# EAGLE design expansion-sn76489-kempton-sd-rev7 (EAGLE 9.6.2)
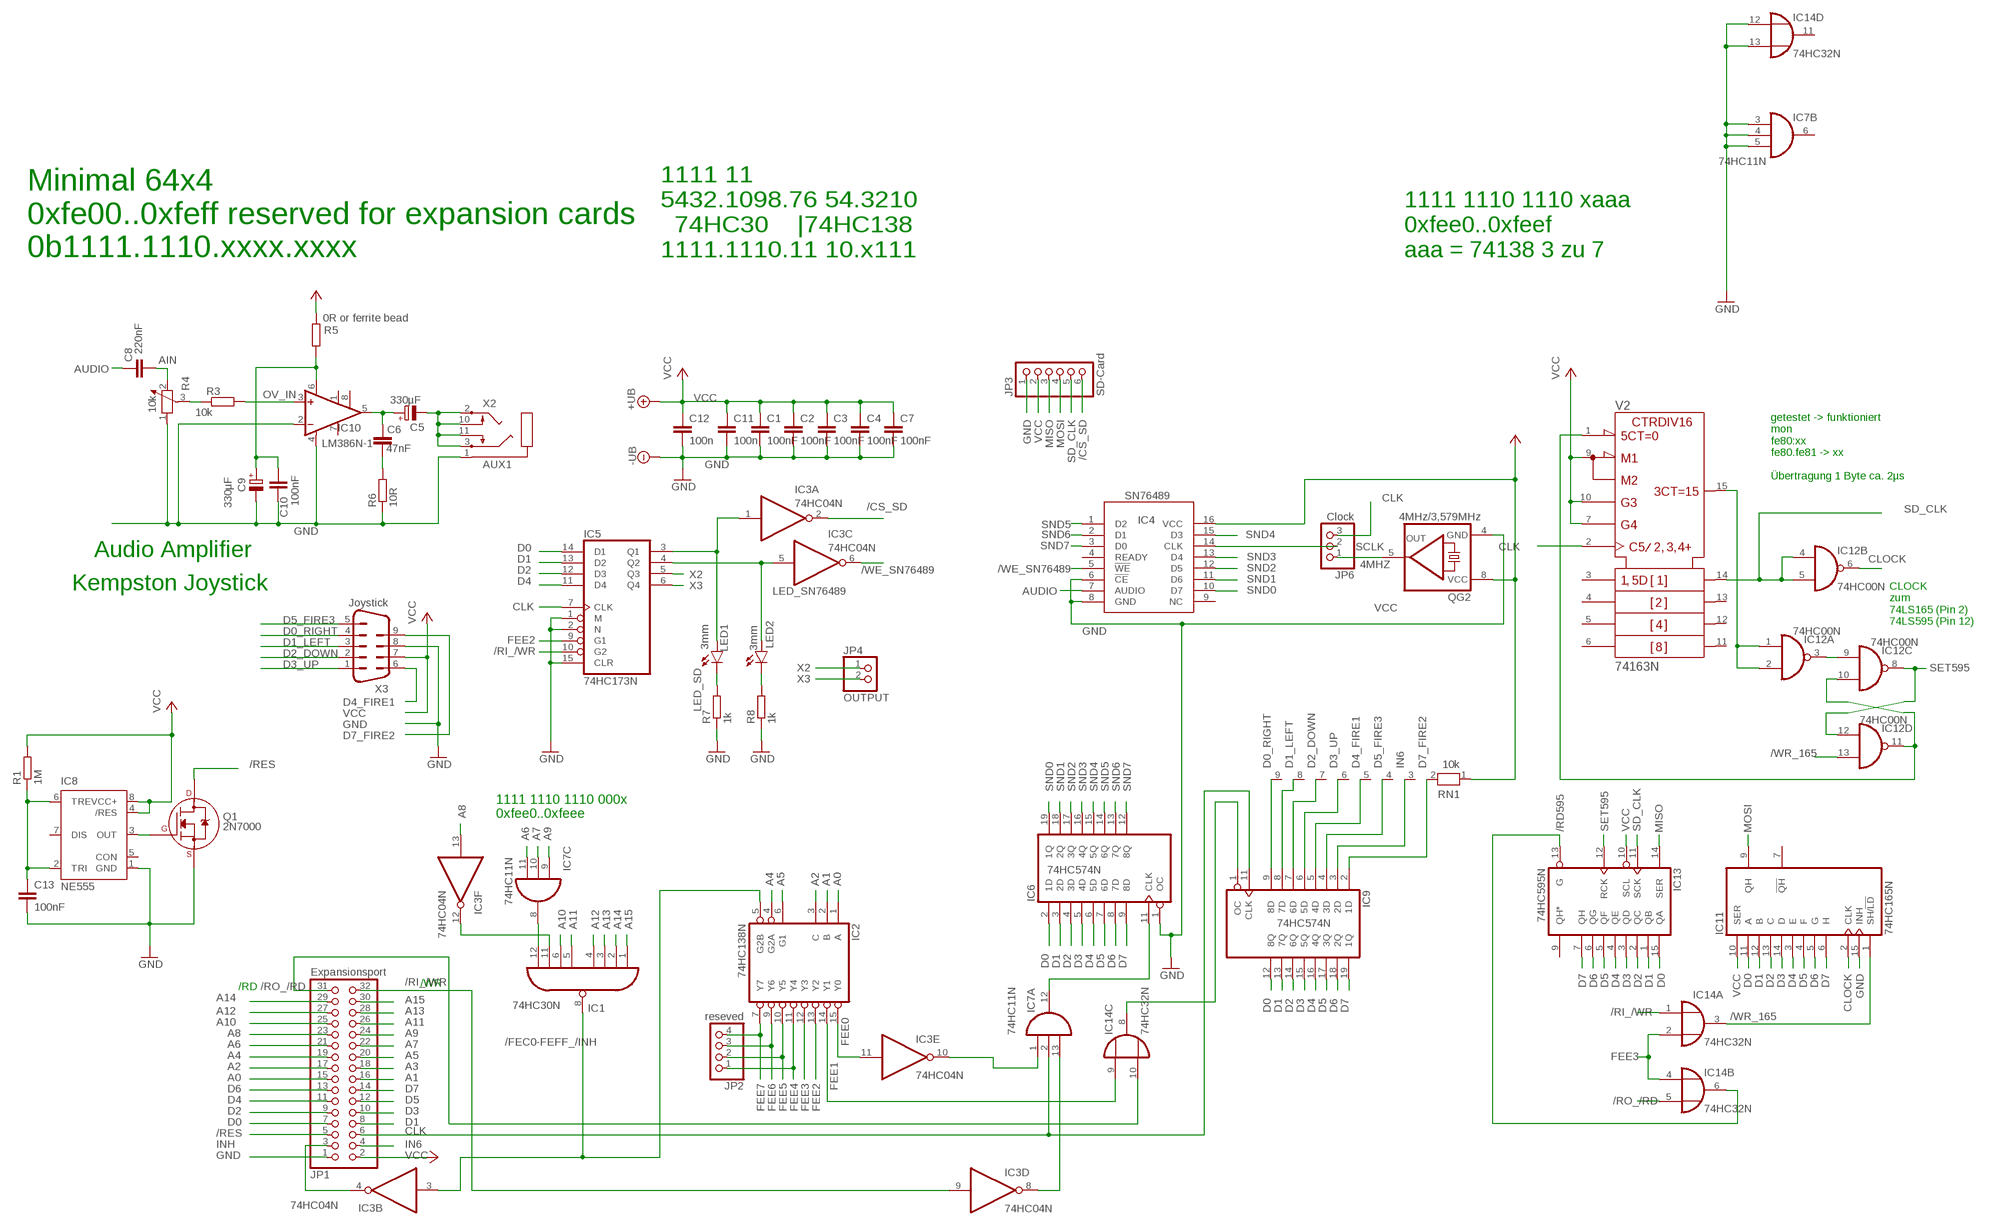
[diagram p0: schematic, sheet 1]

## Parts
C1  100nF  C-EU050-025X075  [C050-025X075]
C2  100nF  C-EU050-025X075  [C050-025X075]
C3  100nF  C-EU050-025X075  [C050-025X075]
C4  100nF  C-EU050-025X075  [C050-025X075]
C5  330µF  CPOL-EUE2.5-7  [E2,5-7]
C6  47nF  C-EU050-025X075  [C050-025X075]
C7  100nF  C-EU050-025X075  [C050-025X075]
C8  220nF  C-EU050-025X075  [C050-025X075]
C9  330µF  CPOL-EUE2.5-7  [E2,5-7]
C10  100nF  C-EU050-025X075  [C050-025X075]
C11  100n  C-EU050-025X075  [C050-025X075]
C12  100n  C-EU050-025X075  [C050-025X075]
C13  100nF  C-EU050-030X075  [C050-030X075]
IC1  74HC30N  [DIL14]
IC2  74HC138N  [DIL16]
IC3  74HC04N  [DIL14]
IC4  SN76489  ALEX-PARTS_SN76489AN  [ALEX-PARTS_DIL16]
IC5  74HC173N  [DIL16]
IC6  74HC574N  [DIL20]
IC7  74HC11N  [DIL14]
IC8  NE555  [DIL-08]
IC9  74HC574N  [DIL20]
IC10  LM386N-1  [DIL08]
IC11  74HC165N  [DIL16]
IC12  74HC00N  [DIL14]
IC13  74HC595N  [DIL16]
IC14  74HC32N  [DIL14]
JP1  Expansionsport  PINHD-2X16  [2X16]
JP2  reseved  PINHD-1X4  [1X04]
JP3  SD-Card  PINHD-1X6  [1X06]
JP4  OUTPUT  PINHD-1X2  [1X02]
JP6  Clock  PINHD-1X3  [1X03]
LED1  3mm  LED3MM  [LED3MM]
LED2  3mm  LED3MM  [LED3MM]
Q1  2N7000  2N7000_TO92  [TO-92]
QG2  4MHz/3,579MHz  QG5460  [DIL08S]
R1  1M  R-EU_0207/10  [0207/10]
R3  10k  R-EU_0207/10  [0207/10]
R4  10k  POTENTIOMETER_PT-10S  [PT-10S]
R5  0R or ferrite bead  R-EU_0207/10  [0207/10]
R6  10R  R-EU_0207/10  [0207/10]
R7  1k  R-EU_0207/2V  [0207/2V]
R8  1k  R-EU_0207/2V  [0207/2V]
RN1  10k  RN08  [RN-9]
V2  74163N  [DIL16]
X2  AUX1  CON-SJ1-352XNSJ1-352XN  [SJ1-352XN]
X3  Joystick  M09-182  [182-009-MALE]

## Nets
4MHZ: JP6.1 QG2.5(OUT)
/CS_SD: IC3.2(A:O) JP3.6
/FEC0-FEFF_/INH: IC1.8(O) IC2.5(G2B) IC3.3(B:I)
/RD595: IC13.13(G) IC14.6(B:O)
/RES: JP1.5 Q1.3(D)
/RI_/WR: IC3.9(D:I) IC5.10(G2) IC14.1(A:I0) JP1.32
/RO_/RD: IC14.5(B:I1) IC14.10(C:I1) JP1.31
/WE_SN76489: IC3.6(C:O) IC4.5(!WE)
/WR_165: IC11.1(SH/!LD) IC12.13(D:I1) IC14.3(A:O)
A0: IC2.1(A) JP1.15
A1: IC2.2(B) JP1.16
A2: IC2.3(C) JP1.17
A3: JP1.18
A4: IC2.4(G2A) JP1.19
A5: IC2.6(G1) JP1.20
A6: IC7.11(C:I2) JP1.21
A7: IC7.10(C:I1) JP1.22
A8: IC3.13(F:I) JP1.23
A9: IC7.9(C:I0) JP1.24
A10: IC1.6(I5) JP1.25
A11: IC1.5(I4) JP1.26
A12: IC1.4(I3) JP1.27
A13: IC1.3(I2) JP1.28
A14: IC1.2(I1) JP1.29
A15: IC1.1(I0) JP1.30
AIN: C8.2 R4.2
AUDIO: C8.1 IC4.7(AUDIO)
AUXOUT1: C5.- X2.2 X2.3 X2.10 X2.11
AVCC [power]: C9.+ C10.1 IC10.6(VS) R5.1
CLK: IC5.7(CLK) IC7.2(A:I1) IC9.11(CLK) JP1.6 JP6.3 V2.2(CLK)
CLOCK: IC11.2(CLK) IC12.6(B:O)
D0: IC5.14(D1) IC6.2(1D) IC9.12(8Q) IC11.11(A) IC13.15(QA) JP1.7
D0_RIGHT: IC9.9(8D) RN1.9 X3.4
D1: IC5.13(D2) IC6.3(2D) IC9.13(7Q) IC11.12(B) IC13.1(QB) JP1.8
D1_LEFT: IC9.8(7D) RN1.8 X3.3
D2: IC5.12(D3) IC6.4(3D) IC9.14(6Q) IC11.13(C) IC13.2(QC) JP1.9
D2_DOWN: IC9.7(6D) RN1.7 X3.2
D3: IC6.5(4D) IC9.15(5Q) IC11.14(D) IC13.3(QD) JP1.10
D3_UP: IC9.6(5D) RN1.6 X3.1
D4: IC5.11(D4) IC6.6(5D) IC9.16(4Q) IC11.3(E) IC13.4(QE) JP1.11
D4_FIRE1: IC9.5(4D) RN1.5 X3.6
D5: IC6.7(6D) IC9.17(3Q) IC11.4(F) IC13.5(QF) JP1.12
D5_FIRE3: IC9.4(3D) RN1.4 X3.5
D6: IC6.8(7D) IC9.18(2Q) IC11.5(G) IC13.6(QG) JP1.13
D7: IC6.9(8D) IC9.19(1Q) IC11.6(H) IC13.7(QH) JP1.14
D7_FIRE2: IC9.2(1D) RN1.2 X3.9
FEE0: IC2.15(Y0) IC3.11(E:I)
FEE1: IC2.14(Y1) IC14.9(C:I0)
FEE2: IC2.13(Y2) IC5.9(G1)
FEE3: IC2.12(Y3) IC14.2(A:I1) IC14.4(B:I0)
FEE4: IC2.11(Y4) JP2.1
FEE5: IC2.10(Y5) JP2.2
FEE6: IC2.9(Y6) JP2.3
FEE7: IC2.7(Y7) JP2.4
GND [power]: C1.2 C2.2 C3.2 C4.2 C7.2 C9.- C10.2 C11.2 C12.2 C13.2 IC4.6(!CE) IC4.8(GND) IC5.1(M) IC5.2(N) IC5.15(CLR) IC6.1(OC) IC7.3(B:I0) IC7.4(B:I1) IC7.5(B:I2) IC8.1(GND) IC10.2(-IN) IC10.4(GND) IC11.15(INH) IC14.12(D:I0) IC14.13(D:I1) JP1.1 JP3.1 Q1.1(S) QG2.4(GND) R4.1 R6.1 R7.1 R8.1 X2.1 X3.8 ; supply symbol labelled -UB
IN6: IC9.3(2D) JP1.4 RN1.3
INH: IC3.4(B:O) JP1.3
INPUT_EN: IC9.1(OC) IC14.8(C:O)
LED_SD: IC3.1(A:I) IC5.3(Q1) LED1.A
LED_SN76489: IC3.5(C:I) IC5.4(Q2) LED2.A
MISO: IC13.14(SER) JP3.3
MOSI: IC11.9(QH) JP3.4
N$1: LED2.K(C) R8.2
N$2: IC3.10(E:O) IC7.1(A:I0)
N$3: IC1.12(I7) IC7.8(C:O)
N$4: C13.1 IC8.2(TRI) IC8.6(TRE) R1.1
N$5: IC8.3(OUT) Q1.2(G)
N$6: C6.2 R6.2
N$7: IC12.1(A:I0) IC12.2(A:I1) V2.15(RCO)
N$8: R3.1 R4.3
N$9: IC12.10(C:I1) IC12.11(D:O) V2.1(!CLR)
N$10: IC12.3(A:O) IC12.9(C:I0)
N$12: LED1.K(C) R7.2
N$19: IC1.11(I6) IC3.12(F:O)
OV_IN: IC10.3(+IN) R3.2
R2C2C3: C5.+ C6.1 IC10.5(OUT)
RI_WR: IC3.8(D:O) IC7.13(A:I2)
SCLK: IC4.14(CLK) JP6.2
SD_CLK: IC12.4(B:I0) IC12.5(B:I1) IC13.11(SCK) JP3.5 V2.14(QA)
SET595: IC12.8(C:O) IC12.12(D:I0) IC13.12(RCK)
SND0: IC4.10(D7) IC6.19(1Q)
SND1: IC4.11(D6) IC6.18(2Q)
SND2: IC4.12(D5) IC6.17(3Q)
SND3: IC4.13(D4) IC6.16(4Q)
SND4: IC4.15(D3) IC6.15(5Q)
SND5: IC4.1(D2) IC6.14(6Q)
SND6: IC4.2(D1) IC6.13(7Q)
SND7: IC4.3(D0) IC6.12(8Q)
SOUND_EN: IC6.11(CLK) IC7.12(A:O)
VCC [power]: C1.1 C2.1 C3.1 C4.1 C7.1 C11.1 C12.1 IC4.16(VCC) IC8.4(/RES) IC8.8(VCC+) IC11.10(SER) IC13.10(SCL) JP1.2 JP3.2 QG2.8(VCC) R1.2 R5.2 RN1.1 V2.7(ENP) V2.9(!LOAD) V2.10(ENT) X3.7 ; supply symbol labelled +UB
X2: IC5.5(Q3) JP4.1
X3: IC5.6(Q4) JP4.2
Unconnected: IC4.4(READY) IC4.9(NC) IC7.6(B:O) IC8.5(CON) IC8.7(DIS) IC10.1(GAIN) IC10.7(BYPASS) IC10.8(GAIN) IC11.7(!QH) IC13.9(QH*) IC14.11(D:O) V2.3(A) V2.4(B) V2.5(C) V2.6(D) V2.11(QD) V2.12(QC) V2.13(QB)

## Notes on the sheet
- Minimal 64x4
  0xfe00..0xfeff reserved for expansion cards
  0b1111.1110.xxxx.xxxx
- 1111 11
  5432.1098.76 54.3210
    74HC30    |74HC138
  1111.1110.11 10.x111
- 1111 1110 1110 xaaa
  0xfee0..0xfeef
  aaa = 74138 3 zu 7
- getestet -> funktioniert
  mon
  fe80:xx
  fe80.fe81 -> xx
  
  Übertragung 1 Byte ca. 2µs
- Audio Amplifier
- Kempston Joystick
- CLOCK
  zum
  74LS165 (Pin 2)
  74LS595 (Pin 12)
- 1111 1110 1110 000x
  0xfee0..0xfeee
- /WR
- /RD

## Power pins joined to a net without a drawn wire
GND: IC1.7(GND) IC2.8(GND) IC3.7(P:GND) IC5.8(GND) IC6.10(GND) IC7.7(P:GND) IC9.10(GND) IC11.8(GND) IC12.7(P:GND) IC13.8(GND) IC14.7(P:GND) V2.8(-UB)
VCC: IC1.14(VCC) IC2.16(VCC) IC3.14(P:VCC) IC5.16(VCC) IC6.20(VCC) IC7.14(P:VCC) IC9.20(VCC) IC11.16(VCC) IC12.14(P:VCC) IC13.16(VCC) IC14.14(P:VCC) V2.16(+UB)

## Library data of the parts
C1-C4 C6-C8 C10-C12 = rcl:C-EU: CAPACITOR, European symbol; SPICEPREFIX: C
C5 C9 = rcl:CPOL-EU: POLARIZED CAPACITOR, European symbol; SPICEPREFIX: C
C13 = rcl:C-EU: CAPACITOR, European symbol
IC1 = 74xx-eu:74*30: 8-input NAND gate
IC2 = 74xx-eu:74*138: 3-line to 8-line DECODER/DEMULTIPLEXER
IC3 = 74xx-eu:74*04: Hex INVERTER
IC4 = squareinator2:ALEX-PARTS_SN76489AN: TI SN76489AN Sound Generator
IC5 = 74xx-eu:74*173: 4-bit D type REGISTER, 3-state
IC6 IC9 = 74xx-eu:74*574: 8-bit D type FLIP FLOP bus driver
IC7 = 74xx-eu:74*11: Triple 3-input AND gate
IC8 = st-microelectronics-2:NE555: General purpose bipolar Timer
IC10 = linear:LM386?-*: Low Voltage Audio Power Amplifier Source: http://cache.national.com/ds/LM/LM386.pdf
IC11 = 74xx-eu:74*165: 8-bit parallel load SHIFT REGISTER
IC12 = 74xx-eu:74*00: Quad 2-input NAND gate
IC13 = 74xx-eu:74*595: 8-bit SHIFT REGISTER, output latch
IC14 = 74xx-eu:74*32: Quad 2-input OR gate
JP1 = pinhead:PINHD-2X16: PIN HEADER
JP2 = pinhead:PINHD-1X4: PIN HEADER
JP3 = pinhead:PINHD-1X6: PIN HEADER
JP4 = pinhead:PINHD-1X2: PIN HEADER
JP6 = pinhead:PINHD-1X3: PIN HEADER
LED1 LED2 = led:LED: LED OSRAM: - CHIPLED LG R971, LG N971, LY N971, LG Q971, LY Q971, LO R971, LY R971 LH N974, LH R974 LS Q976, LO Q976, LY Q976 LO Q996 - Hyper CHIPLED LW Q18S LB Q993, LB Q99A, LB R99A - SideLED LS A670, LO A670, LY A670, LG A670, LP A670 LB A673, LV A673, LT A673, LW A673 LH A674 LY A675 LS A676, LA A676, LO A676, LY A676, LW A676 LS A679, LY A679, LG A679 - Hyper Micro SIDELED® LS Y876, LA Y876, LO Y876, LY Y876 LT Y87S - SmartLED LW L88C, LW L88S LB L89C, LB L89S, LG L890 LS L89K, LO L89K, LY L89K LS L896, LA L896, LO L896, LY L896 - TOPLED LS T670, LO T670, LY T670, LG T670, LP T670 LSG T670, LSP T670, LSY T670, LOP T670, LYG T670 LG T671, LOG T671, LSG T671 LB T673, LV T673, LT T673, LW T673 LH T674 LS T676, LA T676, LO T676, LY T676, LB T676, LH T676, LSB T676, LW T676 LB T67C, LV T67C, LT T67C, LS T67K, LO T67K, LY T67K, LW E67C LS E67B, LA E67B, LO E67B, LY E67B, LB E67C, LV E67C, LT E67C LW T67C LS T679, LY T679, LG T679 LS T770, LO T770, LY T770, LG T770, LP T770 LB T773, LV T773, LT T773, LW T773 LH T774 LS E675, LA E675, LY E675, LS T675 LS T776, LA T776, LO T776, LY T776, LB T776 LHGB T686 LT T68C, LB T68C - Hyper Mini TOPLED® LB M676 - Mini TOPLED Santana® LG M470 LS M47K, LO M47K, LY M47K Source: http://www.osram.convergy.de LUXEON: - LUMILED® LXK2-PW12-R00, LXK2-PW12-S00, LXK2-PW14-U00, LXK2-PW14-V00 LXK2-PM12-R00, LXK2-PM12-S00, LXK2-PM14-U00 LXK2-PE12-Q00, LXK2-PE12-R00, LXK2-PE12-S00, LXK2-PE14-T00, LXK2-PE14-U00 LXK2-PB12-K00, LXK2-PB12-L00, LXK2-PB12-M00, LXK2-PB14-N00, LXK2-PB14-P00, LXK2-PB14-Q00 LXK2-PR12-L00, LXK2-PR12-M00, LXK2-PR14-Q00, LXK2-PR14-R00 LXK2-PD12-Q00, LXK2-PD12-R00, LXK2-PD12-S00 LXK2-PH12-R00, LXK2-PH12-S00 LXK2-PL12-P00, LXK2-PL12-Q00, LXK2-PL12-R00 Source: www.luxeon.com KINGBRIGHT: KA-3528ASYC Source: www.kingbright.com
Q1 = transistors:2N700*: 2N7000, 2N7002, NDS7002A N-channel enhancement mode MOSFET
QG2 = crystal:QG5460: CRYSTAL RESONATOR; OC_FARNELL: unknown; OC_NEWARK: unknown
R1 = rcl:R-EU_: RESISTOR, European symbol
R3 R5-R8 = rcl:R-EU_: RESISTOR, European symbol; SPICEPREFIX: R
R4 = rcl:POTENTIOMETER_: Potentiometer; SPICEMODEL: POT; SPICEPREFIX: X
RN1 = resistor-net:RN08: RESISTOR NETWORK; OC_FARNELL: unknown; OC_NEWARK: unknown
V2 = 74ttl-din:74*163: Synchrounus 4-bit COUNTER
X2 = con-sj1-352xn:CON-SJ1-352XN: MIC/HEADPHONE JACK KS-S stereo microphone/headphone jack SJ1-352XN (CUD Devices)
X3 = con-subd:M09: SUB-D; OC_FARNELL: unknown; OC_NEWARK: unknown

## Net classes
0 default: width 0.254 mm, clearance 0.152 mm
1 power: width 0.406 mm, clearance 0.152 mm

## Board
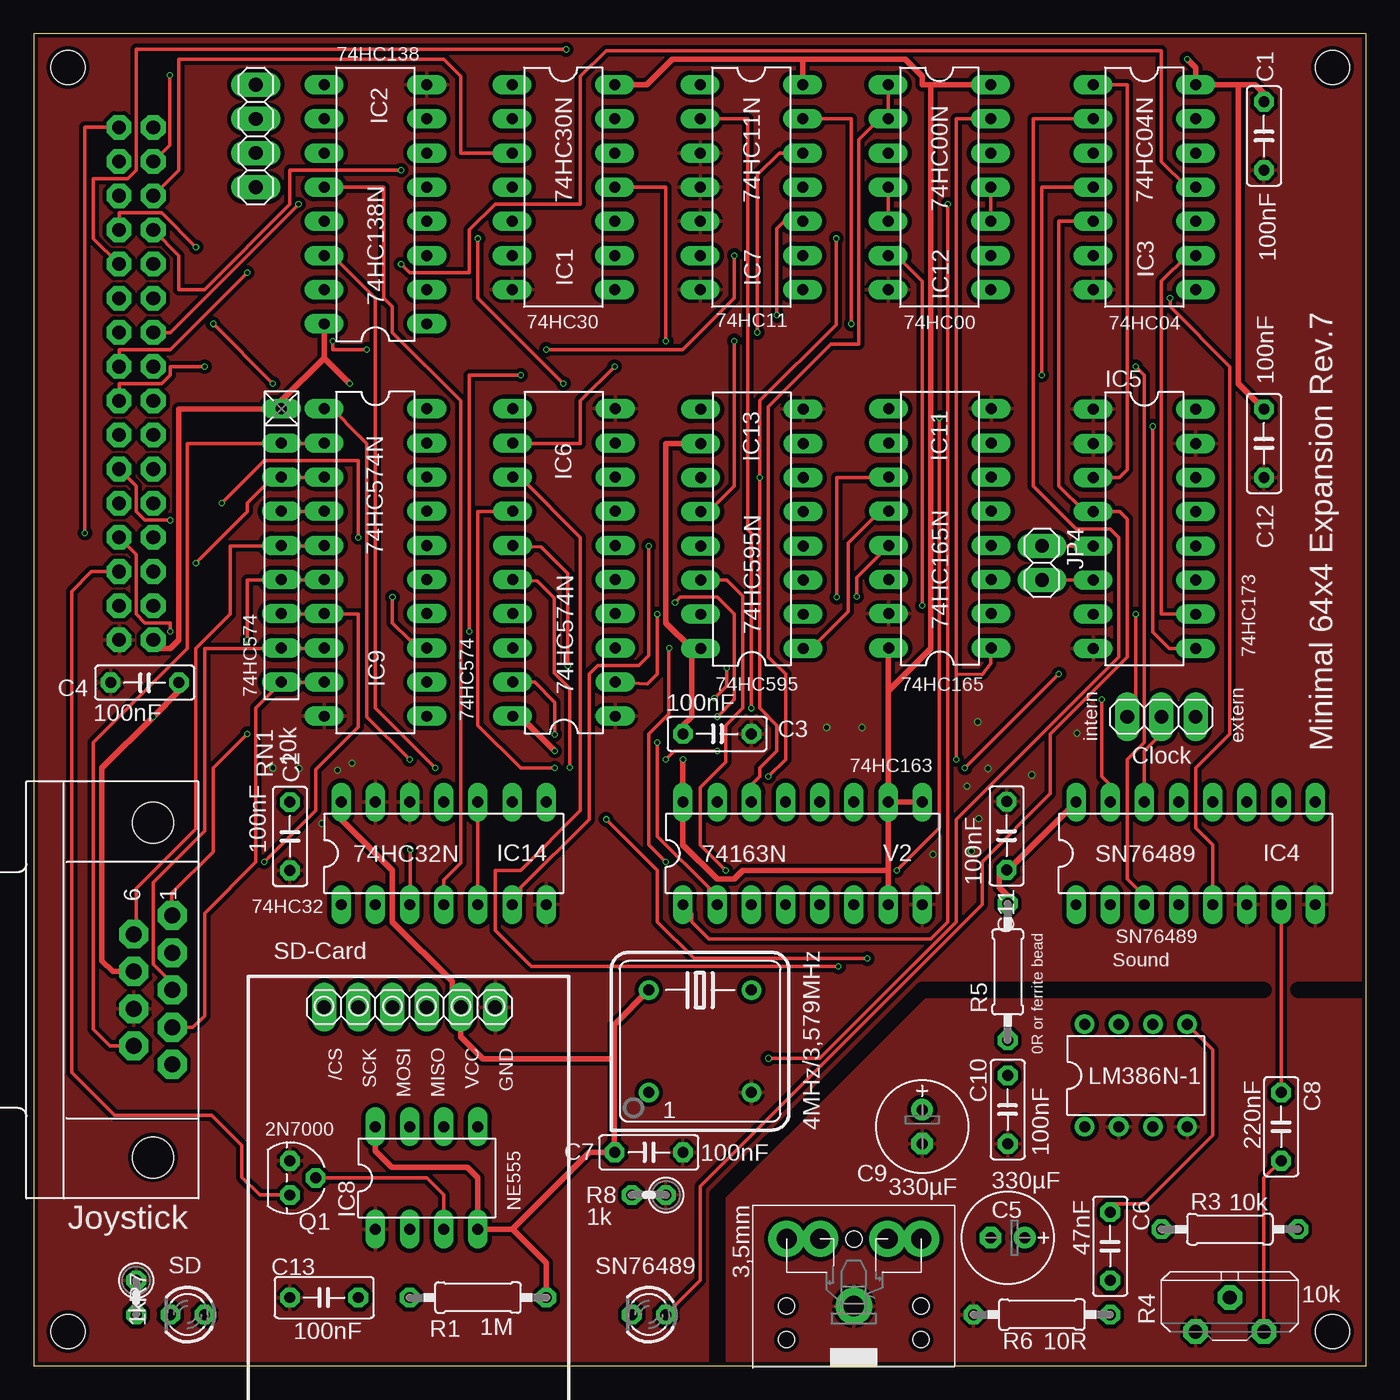
[diagram p1: board, top side]
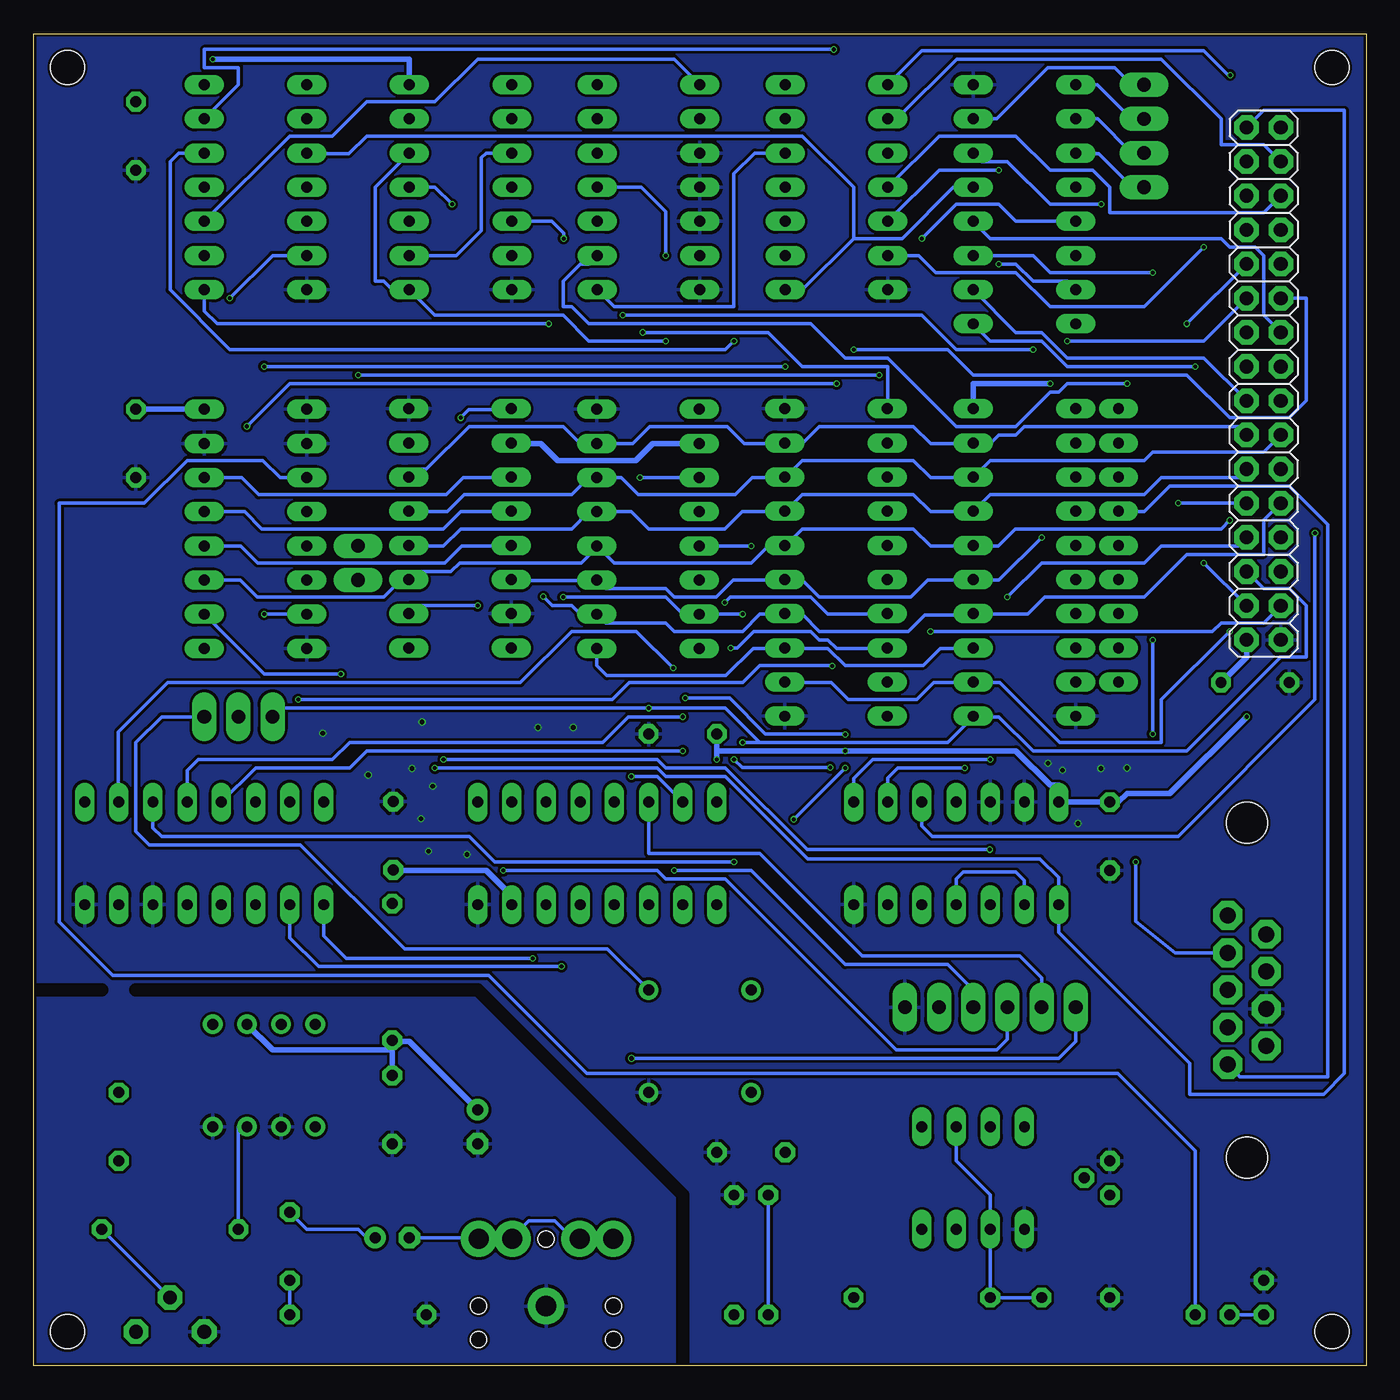
[diagram p2: board, bottom side, seen from below]

Size 99.04 x 99.05 mm. Coordinates in mm from the lower left corner, seen from the top.
Outline: 0,0 99.04,0 99.04,99.05 0,99.05 0,0
Copper layers (1*16): Top 0.035mm / dielectric 1.6mm / Bottom 0.035mm
Design rules "jlcpcb-2layers": minimum track width 5mil, minimum drill 0.3mm, track to track 5mil, track to pad 5mil, pad to pad 5mil, via to via 5mil, smd to smd 5mil, copper to edge 0.2mm, drill to drill 6mil, minimum pad ring 10mil, minimum via ring 3mil, stop-mask expansion 4mil, vias tented up to drill 0mil, thermal gap 10mil
Holes 2.54 mm at 2.54,2.54 2.54,96.52 96.52,2.54 96.52,96.52
tRestrict: 4 lines
bRestrict: 4 lines

### Footprints (pad centres in the part's own frame; a part is rotated, then mirrored left to right if it is on the bottom)
C050-025X075 = drill 0.813 octagon: 1 -2.54,0; 2 2.54,0
E2,5-7 = drill 0.813 pad 1.6: + -1.27,0 | drill 0.813 pad 1.6 octagon: - 1.27,0
C050-030X075 = drill 0.813 octagon: 1 -2.54,0; 2 2.54,0
DIL14 = drill 0.813 long: 1 -7.62,-3.81; 2 -5.08,-3.81; 3 -2.54,-3.81; 4 0,-3.81; 5 2.54,-3.81; 6 5.08,-3.81; 7 7.62,-3.81; 8 7.62,3.81; 9 5.08,3.81; 10 2.54,3.81; 11 0,3.81; 12 -2.54,3.81; 13 -5.08,3.81; 14 -7.62,3.81
DIL16 = drill 0.813 long: 1 -8.89,-3.81; 2 -6.35,-3.81; 3 -3.81,-3.81; 4 -1.27,-3.81; 5 1.27,-3.81; 6 3.81,-3.81; 7 6.35,-3.81; 8 8.89,-3.81; 9 8.89,3.81; 10 6.35,3.81; 11 3.81,3.81; 12 1.27,3.81; 13 -1.27,3.81; 14 -3.81,3.81; 15 -6.35,3.81; 16 -8.89,3.81
ALEX-PARTS_DIL16 = drill 0.813 long: 1 -8.89,-3.81; 2 -6.35,-3.81; 3 -3.81,-3.81; 4 -1.27,-3.81; 5 1.27,-3.81; 6 3.81,-3.81; 7 6.35,-3.81; 8 8.89,-3.81; 9 8.89,3.81; 10 6.35,3.81; 11 3.81,3.81; 12 1.27,3.81; 13 -1.27,3.81; 14 -3.81,3.81; 15 -6.35,3.81; 16 -8.89,3.81
DIL20 = drill 0.813 long: 1 -11.43,-3.81; 2 -8.89,-3.81; 3 -6.35,-3.81; 4 -3.81,-3.81; 5 -1.27,-3.81; 6 1.27,-3.81; 7 3.81,-3.81; 8 6.35,-3.81; 9 8.89,-3.81; 10 11.43,-3.81; 11 11.43,3.81; 12 8.89,3.81; 13 6.35,3.81; 14 3.81,3.81; 15 1.27,3.81; 16 -1.27,3.81; 17 -3.81,3.81; 18 -6.35,3.81; 19 -8.89,3.81; 20 -11.43,3.81
DIL-08 = drill 0.813 long: 1 -3.81,-3.81; 2 -1.27,-3.81; 3 1.27,-3.81; 4 3.81,-3.81; 5 3.81,3.81; 6 1.27,3.81; 7 -1.27,3.81; 8 -3.81,3.81
DIL08 = drill 0.813 pad 1.27: 1 -3.81,-3.81; 2 -1.27,-3.81; 3 1.27,-3.81; 4 3.81,-3.81; 5 3.81,3.81; 6 1.27,3.81; 7 -1.27,3.81; 8 -3.81,3.81
2X16 = drill 1.016 octagon: 1 -19.05,-1.27; 2 -19.05,1.27; 3 -16.51,-1.27; 4 -16.51,1.27; 5 -13.97,-1.27; 6 -13.97,1.27; 7 -11.43,-1.27; 8 -11.43,1.27; 9 -8.89,-1.27; 10 -8.89,1.27; 11 -6.35,-1.27; 12 -6.35,1.27; 13 -3.81,-1.27; 14 -3.81,1.27; 15 -1.27,-1.27; 16 -1.27,1.27; 17 1.27,-1.27; 18 1.27,1.27; 19 3.81,-1.27; 20 3.81,1.27; 21 6.35,-1.27; 22 6.35,1.27; 23 8.89,-1.27; 24 8.89,1.27; 25 11.43,-1.27; 26 11.43,1.27; 27 13.97,-1.27; 28 13.97,1.27; 29 16.51,-1.27; 30 16.51,1.27; 31 19.05,-1.27; 32 19.05,1.27
1X04 = drill 1.016 long: 1 -3.81,0; 2 -1.27,0; 3 1.27,0; 4 3.81,0
1X06 = drill 1.016 long: 1 -6.35,0; 2 -3.81,0; 3 -1.27,0; 4 1.27,0; 5 3.81,0; 6 6.35,0
1X02 = drill 1.016 long: 1 -1.27,0; 2 1.27,0
1X03 = drill 1.016 long: 1 -2.54,0; 2 0,0; 3 2.54,0
LED3MM = drill 0.813 octagon: A -1.27,0; K 1.27,0
TO-92 = drill 0.813 octagon: 1 -1.27,0; 2 0,1.905; 3 1.27,0
DIL08S = drill 0.813: 1 -3.81,-3.81; 4 3.81,-3.81; 5 3.81,3.81; 8 -3.81,3.81
0207/10 = drill 0.813 octagon: 1 -5.08,0; 2 5.08,0
PT-10S = drill 1.016 pad 1.778 octagon: 1 -2.54,-1.27; 2 2.54,-1.27; 3 0,1.27
0207/2V = drill 0.813 octagon: 1 -1.27,0; 2 1.27,0
RN-9 = drill 0.813 long: 1 -10.16,0; 2 -7.62,0; 3 -5.08,0; 4 -2.54,0; 5 0,0; 6 2.54,0; 7 5.08,0; 8 7.62,0; 9 10.16,0
SJ1-352XN = drill 1.5 pad 2.184: 1 0,0; 2 5,-5; 3 5,5; 10 5,-2.5; 11 5,2.5 | hole 1.2: 5,0; 0,5; 0,-5; -2.5,-5; -2.5,5
182-009-MALE = drill 1.194 pad 1.524 octagon: 1 -5.537,10.923; 2 -2.769,10.923; 3 0,10.923; 4 2.769,10.923; 5 5.537,10.923; 6 -4.153,8.08; 7 -1.384,8.08; 8 1.384,8.08; 9 4.153,8.08 | hole 3.048: -12.446,9.501; 12.446,9.501

### Placement (x,y rotation side)
C1  91.44,91.44 270 top
C2  19.05,39.37 270 top
C3  50.8,46.99 0 top
C4  8.26,50.8 180 top
C5  72.39,9.53 180 top
C6  80.01,8.89 270 top
C7  45.72,15.88 0 top
C8  92.71,17.78 270 top
C9  66.04,17.78 270 top
C10  72.39,19.05 270 top
C11  72.31,39.41 90 top
C12  91.44,68.58 270 top
C13  21.59,5.08 180 top
IC1  39.37,87.63 270 top
IC2  25.4,86.36 90 top
IC3  82.55,87.63 270 top
IC4  86.36,38.1 0 top
IC5  82.55,62.23 270 top
IC6  39.41,59.73 90 top
IC7  53.34,87.63 270 top
IC8  29.21,13.97 0 top
IC9  25.4,59.73 270 top
IC10  81.92,21.59 0 top
IC11  67.35,62.27 90 top
IC12  67.31,87.63 270 top
IC13  53.38,62.23 90 top
IC14  30.48,38.1 0 top
JP1  7.62,73.03 90 bottom
JP2  16.51,91.44 90 top
JP3  27.94,26.67 180 top
JP4  74.93,59.69 270 top
JP6  83.82,48.26 180 top
LED1  11.43,3.81 180 top
LED2  45.72,3.81 180 top
Q1  19.05,13.97 270 top
QG2  49.53,24.13 0 top
R1  33.02,5.08 0 top
R3  88.9,10.16 180 top
R4  88.9,3.81 0 top
R5  72.39,29.29 90 top
R6  74.93,3.81 0 top
R7  7.62,5.08 270 top
R8  45.72,12.7 180 top
RN1  18.41,61 270 top
V2  57.15,38.1 0 top
X2  60.96,4.45 90 top
X3  -0.64,27.94 270 top

### Tracks (layer width: path | path; a pad name or v marks a point on that pad's centre or on a via)
4MHZ
  Bottom 0.254: QG2.5 56.4,31 71.48,31 79.22,38.73 90.45,38.73 91.44,39.73 91.44,46.35 89.53,48.26 JP6.1
/CS_SD  (via drill 0.35)
  Top 0.254: IC3.2 74.3,92.71 74.3,65.41 77.47,62.23 80.01,62.23 80.64,61.59 80.64,52.7 68.58,40.64 68.58,33.02 58.42,22.86 v54.61,22.86
  Bottom 0.254: JP3.6 21.59,24.13 22.86,22.86 v54.61,22.86
/FEC0-FEFF_/INH
  Bottom 0.254: IC2.5 30.68,87.63 34.49,83.82 38.1,83.82 | 38.1,83.82 41.91,80.01 IC1.8 | IC3.3 78.7,90.13 75.61,90.13 74.3,91.44 41.91,91.44 38.1,87.63 38.1,83.82
/RD595  (via drill 0.3)
  Top 0.254: IC14.6 36.2,34.92 36.2,35.56 41.27,40.64 41.27,51.44 41.91,52.07 44.97,52.07 45.72,52.82 v45.72,60.96
  Bottom 0.254: IC13.13 v45.72,60.96
/RES
  Top 0.254: JP1.5 4.29,59.05 2.82,57.59 2.82,21.83 6.03,18.61 13.26,18.61 15.48,16.39 15.48,14.01 16.79,12.7 Q1.3
/RI_/WR  (via drill 0.3)
  Top 0.254: IC5.10 83.82,55.88 83.82,80.64 85.72,82.55 IC3.9 | v69.22,44.45 v76.2,51.44
  Bottom 0.254: JP1.32 7.62,93.34 1.63,93.34 1.63,21.75 3.17,20.2 13.14,20.2 13.14,22.5 22.86,32.23 IC14.1 22.86,36.31 24.25,37.7 41.51,37.7 47.62,43.81 52.07,43.81 52.7,44.45 v69.22,44.45 | IC5.10 81.92,51.44 v76.2,51.44
/RO_/RD  (via drill 0.3)
  Top 0.254: IC14.10 IC14.5 | JP1.31 3.81,92.08 v3.81,61.91
  Bottom 0.254: IC14.10 33.02,40.12 32.27,39.37 13.97,39.37 3.81,49.53 v3.81,61.91
/WE_SN76489  (via drill 0.3)
  Top 0.254: IC4.5 87.63,38.73 86.36,40.01 86.36,44.45 88.9,46.99 88.9,74.3 84.45,78.74 v84.45,79.38
  Bottom 0.254: v84.45,79.38 81.28,82.55 IC3.6
/WR_165  (via drill 0.3)
  Top 0.254: v27.98,38.38 27.98,34.33 IC14.3 | 71.12,52.7 71.12,53.34 IC11.1 71.12,52.7 | 71.12,52.7 71.12,52.22 70.49,51.42 68.58,51.44 | 68.58,51.44 v68.58,45.09 | IC12.13 68.58,92.71 68.58,51.44
  Bottom 0.254: v27.98,38.38 41.55,38.38 47.62,44.45 52.07,44.45 52.7,45.09 v68.58,45.09
A0  (via drill 0.3)
  Top 0.254: v12.7,74.3 10.16,74.3 10.16,73.66 9.53,73.03 6.35,73.03 JP1.15
  Bottom 0.254: IC2.1 27.94,76.2 24.13,76.2 22.23,74.3 v12.7,74.3
A1
  Bottom 0.254: IC2.2 26.04,76.83 24.13,76.83 22.23,74.93 12.06,74.93 JP1.16
A2  (via drill 0.3)
  Top 0.254: v15.88,81.28 10.16,75.56 6.35,75.56 JP1.17
  Bottom 0.254: IC2.3 24.77,82.55 23.5,81.28 v15.88,81.28
A4
  Bottom 0.254: IC2.4 27.94,83.82 10.79,83.82 10.16,83.19 8.26,83.19 7.62,82.55 7.62,78.11 JP1.19
A5  (via drill 0.3)
  Top 0.254: v19.68,86.36 10.16,76.83 JP1.20
  Bottom 0.254: IC2.6 28.57,89.53 26.67,89.53 23.5,86.36 v19.68,86.36
A6  (via drill 0.3)
  Top 0.254: v52.07,82.55 52.07,79.38 48.26,75.56 v38.1,75.56
  Bottom 0.254: v52.07,82.55 52.07,85.8 53.9,87.63 IC7.11 | v38.1,75.56 31.11,75.56 29.21,73.66 13.34,73.66 10.16,70.48 5.71,70.48 4.45,71.75 4.45,79.38 JP1.21
A7  (via drill 0.3)
  Top 0.254: IC7.10 55.8,85.09 55.24,84.53 v55.24,78.11 | v24.77,75.56 22.23,75.56 v22.23,76.2
  Bottom 0.254: v55.24,78.11 33.02,78.11 30.48,75.56 v24.77,75.56 | v22.23,76.2 12.06,76.2 JP1.22
A8  (via drill 0.3)
  Top 0.254: v39.57,97.87 7.62,97.87 7.62,88.9 6.99,88.27 4.45,88.27 4.45,83.82 JP1.23
  Bottom 0.254: IC3.13 83.82,95.25 83.82,96.52 86.36,96.52 86.36,97.87 v39.57,97.87
A9  (via drill 0.3)
  Top 0.254: v13.34,77.47 v17.78,73.03
  Bottom 0.254: IC7.9 57.78,81.92 58.42,81.92 59.69,80.64 59.69,78.74 59.05,78.74 57.78,77.47 41.27,77.47 38.73,74.93 35.56,74.93 30.48,69.85 26.04,69.85 23.5,72.39 22.86,72.39 22.23,73.03 v17.78,73.03 | JP1.24 v13.34,77.47
A10  (via drill 0.3)
  Top 0.254: v12.06,83.19 9.53,85.72 6.35,85.72 JP1.25
  Bottom 0.254: IC1.6 33.26,82.55 31.99,81.28 26.04,81.28 23.5,78.74 16.51,78.74 v12.06,83.19
A11  (via drill 0.3)
  Top 0.254: v27.3,88.9 19.05,88.9 19.05,86.36 12.7,80.01 10.79,80.01 10.79,82.55 JP1.26
  Bottom 0.254: IC1.5 31.75,88.9 v27.3,88.9
A12
  Bottom 0.254: IC1.4 31.75,91.44 26.04,91.44 23.5,88.9 20.32,88.9 19.05,87.63 19.05,85.72 7.62,85.72 JP1.27
A13
  Top 0.254: IC1.3 31.75,90.17 31.75,95.89 30.48,97.16 10.79,97.16 10.79,88.9 JP1.28
A14
  Bottom 0.254: IC1.2 34.88,92.71 30.44,97.16 15.24,97.16 10.79,92.71 10.79,90.81 7.62,90.81 JP1.29
A15  (via drill 0.3)
  Top 0.254: v10.12,95.96 10.12,90.77 JP1.30
  Bottom 0.254: IC1.1 33.02,97.79 12.06,97.79 10.24,95.96 v10.12,95.96
AIN
  Top 0.254: C8.2 91.44,13.97 R4.2
AUDIO
  Top 0.254: IC4.7 C8.1
AUXOUT1
  Top 0.254: X2.3 56.52,9.53 58.42,9.53 X2.11 | X2.10 63.5,9.53 65.41,9.53 X2.2
  Bottom 0.254: C5.- 66.04,9.53 X2.2 | X2.11 59.05,9.53 60.33,10.79 62.23,10.79 63.5,9.53 X2.10
AVCC
  Bottom 0.406: 72.39,23.5 C10.1 | IC10.6 81.28,23.5 72.39,23.5 | 72.39,23.5 72.39,24.13 | C9.+ 71.12,24.13 72.39,24.13 | 72.39,24.13 R5.1
CLK  (via drill 0.3)
  Top 0.254: v81.92,55.88 81.92,48.9 JP6.3 | V2.2 50.16,34.92 50.16,35.56 46.35,39.37 v46.35,46.35 | IC7.2 53.06,92.71 53.06,62.19 53.34,61.91 v53.34,48.9
  Bottom 0.254: v81.92,55.88 IC5.7 | 45.09,46.35 31.11,46.35 29.21,48.26 | 45.09,46.35 v46.35,46.35 | 45.09,46.35 47.62,48.9 v53.34,48.9 80.64,48.9 JP6.3 | JP1.6 7.62,57.78 5.71,57.78 4.45,56.52 4.45,52.7 6.35,52.7 13.34,45.72 24.77,45.72 27.3,48.26 29.21,48.26 | 29.21,48.26 IC9.11
CLOCK  (via drill 0.3)
  Top 0.254: v66.04,56.52 66.04,80.64 64.14,82.55 IC12.6
  Bottom 0.254: v66.04,56.52 71.12,56.52 IC11.2
D0  (via drill 0.3)
  Top 0.254: v46.35,55.88 46.35,51.44 45.6,50.68 IC6.2 | JP1.7 7.62,60.33 7.62,55.88 8.26,55.24 10.16,55.24 v10.16,54.61 | v59.69,57.15 59.69,66.04 63.5,66.04 IC11.11
  Bottom 0.254: IC5.14 83.58,66.04 82.31,64.77 68.38,64.77 67.11,66.04 64.14,66.04 IC11.11 | IC6.2 43.18,50.8 39.77,50.8 38.5,49.53 33.42,49.53 32.15,50.8 29.21,50.8 | v46.35,55.88 IC13.15 50.8,55.88 52.07,57.15 v59.69,57.15 | v10.16,54.61 15.24,49.53 15.24,46.35 22.78,46.35 27.23,50.8 29.21,50.8 | 29.21,50.8 IC9.12
D0_RIGHT
  Top 0.254: 18.41,50.8 21.59,50.8 IC9.9 | 18.41,50.8 16.51,48.9 16.51,37.47 12.7,33.66 12.7,26.04 11.84,25.17 X3.4 | 18.41,50.8 RN1.9
D1  (via drill 0.3)
  Top 0.254: IC13.1 57.78,53.34 60.52,56.08 60.52,61.16 63.5,64.14 IC11.12 | v26.67,57.15 26.67,55.24 27.94,53.98 29.21,53.98 IC9.13
  Bottom 0.254: IC5.13 83.34,63.5 82.07,62.23 68.58,62.23 67.31,63.5 64.14,63.5 IC11.12 | IC9.13 29.21,53.34 31.67,53.34 32.94,52.07 38.73,52.07 40.01,53.34 43.18,53.34 IC6.3 43.81,53.34 45.56,53.34 47.59,51.32 56.44,51.32 57.19,52.07 IC13.1 | JP1.8 9.53,60.96 15.24,60.96 16.51,59.69 24.13,59.69 v26.67,57.15
D1_LEFT
  Top 0.254: 18.41,53.34 21.59,53.34 IC9.8 | 18.41,53.34 12.7,53.34 12.7,39.77 8.89,35.96 8.89,29.84 10.16,28.57 10.16,27.94 X3.3 | 18.41,53.34 RN1.8
D2  (via drill 0.3)
  Top 0.254: IC11.13 61.16,58.62 v61.16,57.19
  Bottom 0.254: 29.21,55.88 29.25,55.84 32.82,55.84 34.05,54.61 40.64,54.61 41.91,55.88 43.18,55.88 IC6.4 43.81,55.88 45.09,55.88 46.35,54.61 51.44,54.61 52.07,55.24 56.52,55.24 57.15,55.88 IC13.2 58.42,55.88 59.05,56.52 60.48,56.52 v61.16,57.19 | IC5.12 83.66,60.96 82.39,59.69 68.5,59.69 67.23,60.96 64.14,60.96 IC11.13 | JP1.9 7.62,62.87 7.62,60.33 13.34,60.33 16.51,57.15 23.89,57.15 25.16,55.88 29.21,55.88 | 29.21,55.88 IC9.14
D2_DOWN  (via drill 0.3)
  Top 0.254: 21.59,55.88 18.41,55.88 RN1.7 | 21.59,55.88 24.13,55.88 24.13,47.51 20.95,44.33 20.95,41.27 v17.14,37.47 | 21.59,55.88 IC9.7
  Bottom 0.254: v17.14,37.47 17.14,33.06 14.21,30.71 X3.2
D3  (via drill 0.3)
  Top 0.254: v13.97,64.14 17.14,67.31 24.13,67.31 v24.13,61.59
  Bottom 0.254: IC11.14 63.5,58.42 62.23,58.42 62.19,58.38 57.83,58.38 57.78,58.42 IC13.3 57.15,58.42 56.52,57.78 52.07,57.78 51.44,57.15 48.3,57.15 47.03,58.42 43.81,58.42 IC6.5 43.18,58.42 41.91,58.42 40.64,57.15 33.85,57.15 32.58,58.42 29.21,58.42 | v13.97,64.14 JP1.10 | v24.13,61.59 27.3,58.42 29.21,58.42 | 29.21,58.42 IC9.15
D3_UP  (via drill 0.3)
  Top 0.254: 18.41,58.42 21.59,58.42 IC9.6 | 18.41,58.42 15.88,58.42 v15.88,53.98 | v15.88,46.99 13.34,44.45 13.34,38.22 10.28,35.16 X3.1 | 18.41,58.42 RN1.6
  Bottom 0.254: v15.88,46.99 v15.88,53.98
D4  (via drill 0.3)
  Top 0.254: JP1.11 7.62,65.41 7.62,63.5 8.26,62.87 v10.16,62.87
  Bottom 0.254: IC5.11 83.7,58.42 82.43,57.15 73.03,57.15 71.75,58.42 IC11.3 71.12,59.05 68.02,59.05 67.39,59.69 58.34,59.69 57.11,60.92 | 29.21,60.96 32.38,60.96 33.66,62.23 41.91,62.23 42.55,61.59 43.18,61.59 IC6.6 43.81,60.96 44.45,60.96 45.72,59.69 55.88,59.69 57.11,60.92 | 29.21,60.96 IC9.16 | 57.11,60.92 57.15,60.96 IC13.4 | v10.16,62.87 10.79,62.23 26.07,62.23 27.34,60.96 29.21,60.96
D4_FIRE1
  Top 0.254: 18.41,60.96 21.59,60.96 IC9.5 | 18.41,60.96 14.61,60.96 14.61,55.88 12.06,53.34 12.06,39.93 7.62,35.48 7.62,32.38 X3.6 | 18.41,60.96 RN1.5
D5
  Bottom 0.254: IC11.4 71.12,60.96 68.58,60.96 67.31,62.23 59.05,62.23 57.78,63.5 IC13.5 54.61,63.5 53.34,62.23 47.66,62.23 46.4,63.5 43.81,63.5 IC6.7 43.18,64.14 42.55,64.14 41.91,64.77 33.66,64.77 32.38,63.5 29.21,63.5 IC9.17 29.21,64.14 28.57,64.14 27.94,64.77 16.51,64.77 15.24,66.04 9.53,66.04 JP1.12
D5_FIRE3
  Top 0.254: RN1.4 18.41,63.5 21.59,63.5 IC9.4
  Bottom 0.254: RN1.4 18.41,63.5 16.51,63.5 14.61,65.41 5.71,65.41 2.86,62.55 2.86,21.47 9.41,21.47 9.56,21.67 X3.5
D6
  Bottom 0.254: IC11.5 71.12,63.5 68.3,63.5 67.03,64.77 59.05,64.77 57.78,66.04 IC13.6 55.36,66.04 54.09,64.77 46.91,64.77 45.64,66.04 43.81,66.04 IC6.8 43.18,66.67 42.55,66.67 41.91,67.31 33.66,67.31 32.38,66.04 29.21,66.04 IC9.18 29.21,66.67 28.57,66.67 27.94,67.31 16.51,67.31 15.88,67.94 7.62,67.94 JP1.13
D7
  Bottom 0.254: IC11.6 71.12,66.67 69.85,66.67 66.67,69.85 59.69,69.85 58.42,68.58 IC13.7 54.53,68.58 53.26,69.85 47.51,69.85 46.24,68.58 43.81,68.58 IC6.9 43.18,68.58 41.91,68.58 40.64,69.85 33.66,69.85 32.38,68.58 29.21,68.58 | JP1.14 9.53,69.85 25.4,69.85 26.04,69.22 27.3,69.22 27.94,68.58 29.21,68.58 | 29.21,68.58 IC9.19
D7_FIRE2
  Top 0.254: 18.41,68.58 21.59,68.58 IC9.2 | 18.41,68.58 11.43,68.58 11.43,53.34 4.45,46.35 4.45,25 5.66,23.79 X3.9 | 18.41,68.58 RN1.2
FEE0  (via drill 0.3)
  Top 0.254: v27.3,81.92 27.94,81.28 32.38,81.28 32.38,84.45 34.29,86.36 40.64,86.36 40.64,95.89 42.55,97.79 83.82,97.79 83.82,89.53 85.72,87.63 IC3.11
  Bottom 0.254: IC2.15 22.23,80.64 24.77,80.64 26.04,81.92 v27.3,81.92
FEE1  (via drill 0.3)
  Top 0.254: v29.84,44.45 25.4,48.9 25.4,79.38 22.23,82.55 IC2.14
  Bottom 0.254: IC14.9 35.56,43.7 34.81,44.45 v29.84,44.45
FEE2  (via drill 0.3)
  Top 0.254: v33.02,83.82 33.02,79.38 v39.37,73.03 | v83.19,69.85 83.19,54.57 84.42,53.34 IC5.9
  Bottom 0.254: IC2.13 26.04,85.09 27.3,86.36 30.48,86.36 v33.02,83.82 | v39.37,73.03 80.01,73.03 v83.19,69.85
FEE3
  Top 0.254: IC2.12 26.04,87.63 26.04,79.38 26.67,78.74 26.67,76.83 31.75,71.75 31.75,37.39 30.48,36.12 IC14.4
  Bottom 0.254: IC14.2 25.4,36.08 26.04,36.71 29.96,36.71 30.48,36.2 IC14.4
FEE4
  Bottom 0.254: IC2.11 21.55,90.13 19.88,90.13 17.42,87.67 16.55,87.67 JP2.1
FEE5
  Bottom 0.254: IC2.10 19.96,92.71 17.42,90.17 JP2.2
FEE6
  Bottom 0.254: IC2.9 20,95.25 17.46,92.71 JP2.3
FEE7
  Bottom 0.254: IC2.7 27.46,92.71 23.65,96.52 18.69,96.52 17.42,95.25 JP2.4
GND  (via drill 0.35)
  other vias: 69.37,43.1 70.92,44.41 70.17,47.86 77.55,47.03 61.56,47.47 58.94,47.47 66.83,38.02 69.69,38.26 70.25,40.68 74.18,43.93 22.58,44.29 21.43,40.32 19.72,44.41 17.78,44.45 23.65,44.81
  pour Bottom (isolate 0.203): 0,99.06 0,0 99.06,0 99.06,99.06
  pour Top (isolate 0.305): 0,99.06 0,0 100.33,0 100.33,99.06
IN6  (via drill 0.3)
  Top 0.254: IC9.3 21.59,66.04 18.41,66.04 RN1.3 18.41,66.67 15.88,64.14 15.88,63.5 v12.06,59.69
  Bottom 0.254: v12.06,59.69 JP1.4
INH  (via drill 0.3)
  Top 0.254: IC3.4 74.93,87.63 v74.93,73.66 | v36.2,73.66 32.38,73.66 v32.38,54.61
  Bottom 0.254: v36.2,73.66 v74.93,73.66 | v32.38,54.61 11.43,54.61 10.79,55.24 7.62,55.24 JP1.3
INPUT_EN  (via drill 0.3)
  Top 0.254: v27.94,45.09 24.77,48.26 24.77,68.58 21.59,71.75 IC9.1
  Bottom 0.254: IC14.8 38.1,43.66 36.67,45.09 v27.94,45.09
LED_SD
  Top 0.254: IC3.1 81.28,95.25 81.28,66.64 80.69,66.04 IC5.3
  Bottom 0.254: LED1.A 12.7,15.99 18.45,21.75 57.94,21.75 65.21,29.01 93.15,29.01 97.16,33.02 97.16,64.14 90.81,64.14 87.63,67.31 81.99,67.31 80.72,66.04 IC5.3
LED_SN76489
  Top 0.254: LED2.A 49.53,6.35 49.53,13.34 70.48,34.29 70.48,37.47 75.56,42.55 75.56,46.99 81.28,52.7 81.28,62.94 80.72,63.5 IC5.4 78.11,63.5 76.2,65.41 76.2,85.09 IC3.5
MISO  (via drill 0.3)
  Top 0.254: v51.44,36.83 49.53,38.73 49.53,43 51.44,44.9 51.44,47.62 52.7,48.9 52.7,57.23 51.51,58.42 IC13.14
  Bottom 0.254: v51.44,36.83 45.72,36.83 38.73,29.84 31.11,29.84 29.21,27.94 JP3.3
MOSI  (via drill 0.3)
  Top 0.254: v67.31,70.48 67.31,40.01 v64.14,36.83
  Bottom 0.254: v67.31,70.48 66.72,71.08 64.17,71.08 64.14,71.12 IC11.9 | v64.14,36.83 52.7,36.83 52.07,36.2 47.62,36.2 34.92,23.5 27.46,23.5 26.67,24.29 JP3.4
N$1
  Bottom 0.254: R8.2 LED2.K
N$2
  Bottom 0.254: IC7.1 51.44,97.16 66.04,97.16 69.22,93.98 74.3,93.98 76.83,91.44 80.01,91.44 IC3.10
N$3
  Bottom 0.254: IC1.12 45.44,90.17 46.99,88.62 46.99,78.74 55.88,78.74 IC7.8
N$4
  Bottom 0.254: C13.1 R1.1 IC8.2 27.94,12.7 30.48,15.24 IC8.6
N$5
  Top 0.254: IC8.3 30.48,12.7 29.21,13.97 Q1.2
N$6
  Bottom 0.254: C6.2 R6.2
N$7  (via drill 0.3)
  Top 0.254: v54.61,43.81 55.88,45.09 55.88,51.44 54.61,52.7 54.61,71.32 59.25,75.96 61.32,75.96 61.32,91.16 62.87,92.71 IC12.2 IC12.1
  Bottom 0.254: V2.15 52.7,43.81 v54.61,43.81
N$8
  Bottom 0.254: R4.3 R3.1
N$9  (via drill 0.3)
  Top 0.254: V2.1 48.9,33.66 48.9,33.02 50.16,31.75 66.67,31.75 67.94,33.02 v67.94,86.36 | IC12.11 IC12.10
  Bottom 0.254: v67.94,86.36 69.22,87.63 IC12.11
N$10
  Bottom 0.254: IC12.9 67.63,82.55 65.76,84.42 65.76,89.81 65.41,90.17 IC12.3
N$12
  Bottom 0.254: LED1.K R7.2
N$19  (via drill 0.3)
  Top 0.254: IC1.11 46.99,87.63 v46.99,76.2
  Bottom 0.254: v46.99,76.2 47.62,75.56 84.45,75.56 88.9,80.01 88.9,89.53 88.27,90.17 IC3.12
OV_IN
  Bottom 0.254: R3.2 83.82,17.78 IC10.3
R2C2C3
  Top 0.254: IC10.5 87.63,23.5 87.63,17.14 82.55,12.06 80.01,12.06 C6.1
  Bottom 0.254: C6.1 78.74,10.16 74.93,10.16 74.3,9.53 C5.+
RI_WR  (via drill 0.3)
  Top 0.254: IC7.13 60.76,92.71 v60.76,77.47
  Bottom 0.254: v60.76,77.47 85.41,77.47 86.36,78.42 IC3.8
SCLK
  Top 0.254: IC4.14 82.55,45.72 83.82,46.99 JP6.2
SD_CLK  (via drill 0.3)
  Top 0.254: IC12.4 IC12.5 | V2.14 53.34,43.18 53.98,43.81 53.98,44.45 55.24,45.72 55.24,47.62 53.98,48.9 v53.98,66.04 53.98,71.75 59.65,77.43 v59.65,83.82
  Bottom 0.254: V2.14 53.34,38.1 45.09,38.1 37.47,30.48 25.76,30.48 24.13,28.85 JP3.5 | v53.98,66.04 IC13.11 | v59.65,83.82 59.65,84.22 60.52,85.09 IC12.5
SET595  (via drill 0.3)
  Top 0.254: v52.07,76.2 52.07,65.41 50.16,63.5 IC13.12
  Bottom 0.254: v52.07,76.2 57.78,76.2 59.69,78.11 69.22,78.11 IC12.8 72.39,80.01 73.03,80.64 73.66,80.64 73.66,87.63 IC12.12
SND0  (via drill 0.3)
  Top 0.254: v38.73,46.95 38.73,49.33 37.23,50.84 IC6.19 | v50.6,49.65 51.51,50.56 v51.51,51.87
  Bottom 0.254: v38.73,46.95 38.77,46.99 44.65,46.99 47.31,49.65 v50.6,49.65 | v51.51,51.87 54.25,54.61 59.05,54.61 62.87,50.8 89.06,50.8 92.75,47.11 92.75,41.95 IC4.10
SND1  (via drill 0.3)
  Top 0.254: v47.23,53.38 47.19,53.34 47.19,48.46 45.72,46.99 45.72,38.73 v46.99,37.47
  Bottom 0.254: v47.23,53.38 46.75,53.38 45.52,54.61 41.27,54.61 40.64,53.98 40.01,53.98 39.37,53.34 36.2,53.34 IC6.18 | v46.99,37.47 64.77,37.47 66.67,39.37 89.53,39.37 90.17,40.01 IC4.11
SND2  (via drill 0.3)
  Top 0.254: v47.66,56.75 48.06,57.15 50.8,57.15 52.07,55.88 52.07,49.53 v50.8,48.26
  Bottom 0.254: v47.66,56.75 47.27,57.15 41.27,57.15 40.01,55.88 36.2,55.88 IC6.17 | v50.8,48.26 54.85,48.26 56.75,46.35 75.56,46.35 76.83,45.09 86.8,45.09 87.63,44.25 IC4.12
SND3  (via drill 0.3)
  Top 0.254: v39.85,44.49 39.85,50.36 38.7,51.51 38.7,57.07 37.43,58.34 IC6.16 | v46.99,45.09 47.62,45.72 v50.8,45.72
  Bottom 0.254: v46.99,45.09 46.4,44.49 v39.85,44.49 | v50.8,45.72 74.3,45.72 75.56,44.45 82.55,44.45 IC4.13
SND4  (via drill 0.3)
  Top 0.254: v39.69,52.03 39.69,58.9 37.73,60.86 IC6.15 | v79.38,49.53 79.38,43.81 80.01,43.18 IC4.15
  Bottom 0.254: v39.69,52.03 39.73,52.07 45.09,52.07 46.35,50.8 54.77,50.8 56.04,49.53 v79.38,49.53
SND5  (via drill 0.3)
  Top 0.254: v38.73,44.45 36.2,44.45 33.02,47.62 33.02,63.5 35.56,63.5 IC6.14 | v42.55,40.64 46.35,36.83 46.35,33.02 49.09,30.28 v61.95,30.28
  Bottom 0.254: v42.55,40.64 v38.73,44.45 | v61.95,30.28 75.8,30.28 77.47,31.95 IC4.1
SND6  (via drill 0.3)
  Top 0.254: v59.81,29.69 36.99,29.69 34.29,32.38 34.29,36.83 36.2,36.83 40.64,41.27 40.64,61.59 36.2,66.04 IC6.13
  Bottom 0.254: v59.81,29.69 77.87,29.69 80.01,31.83 IC4.2
SND7  (via drill 0.3)
  Top 0.254: v43.18,74.3 40.64,71.75 40.64,68.58 36.2,68.58 IC6.12 | v81.92,74.3 82.55,73.66 82.55,46.35 81.28,45.09 81.28,36.2 82.55,34.92 IC4.3
  Bottom 0.254: v81.92,74.3 v43.18,74.3
SOUND_EN  (via drill 0.3)
  Top 0.254: v53.78,76.83 53.78,88.54 55.4,90.17 IC7.12
  Bottom 0.254: v53.78,76.83 44.45,76.83 41.91,74.3 35.56,74.3 35.56,71.75 IC6.11
VCC  (via drill 0.3)
  Top 0.406: IC1.14 45.56,95.25 47.47,97.16 57.15,97.16 | IC7.14 57.15,97.16 | 66.67,95.25 66.04,95.25 66.04,95.89 64.77,97.16 57.15,97.16 | 66.67,95.25 IC12.14 | 89.53,95.25 90.81,95.25 91.44,94.61 C1.1 | 89.53,95.25 IC3.14 86.36,96.52 v85.72,97.16 | C12.1 89.53,73.03 89.53,95.25 | 21.59,74.93 18.41,71.75 RN1.1 18.41,71.12 10.79,71.12 10.79,53.98 10.16,53.34 8.89,53.34 JP1.2 | IC2.16 21.59,74.93 | 21.59,74.93 v23.5,73.03 | X3.7 5.88,29.32 5.08,30.12 5.08,44.45 v8.89,48.26 10.79,50.16 C4.1 | R5.2 72.39,34.92 71.75,35.56 71.75,36.83 C11.1 72.39,36.83 IC4.16 | V2.10 63.5,36.83 | 63.5,36.83 V2.7 | V2.10 63.5,50.16 | 63.5,50.16 63.5,53.34 IC11.16 | V2.10 V2.9 | 43.14,22.82 43.14,25.36 QG2.8 | 43.14,22.82 43.14,15.91 C7.1 41.27,15.88 35.56,10.16 | 43.14,22.82 33.38,22.82 31.75,24.45 JP3.2 31.11,27.3 31.11,28.57 26.67,33.02 26.67,36.83 22.86,40.64 IC14.14 | v48.26,45.09 V2.16 48.26,38.73 50.8,36.2 52.07,36.2 52.7,36.83 63.5,36.83 | v38.73,45.72 36.2,48.26 IC6.20 | 48.9,52.7 49.53,53.34 IC13.16 48.9,52.7 | 48.9,52.7 48.9,48.26 48.26,47.62 C3.1 | IC13.10 46.99,68.58 46.99,55.24 48.9,53.34 48.9,52.7 | 66.67,95.25 66.67,53.34 63.5,50.16 | R1.2 38.1,7.66 35.6,10.16 35.56,10.16 | 35.56,10.16 IC8.4 33.02,13.97 32.23,14.76 26.63,14.76 25.4,15.99 IC8.8
  Bottom 0.406: C12.1 IC5.16 | IC12.14 71.12,97.16 v85.72,97.16 | IC9.20 29.21,73.03 v23.5,73.03 | C4.1 8.89,52.7 JP1.2 | V2.7 63.5,34.92 65.41,36.83 71.75,36.83 C11.1 | C3.1 48.26,45.72 | 48.26,45.72 v48.26,45.09 | 48.26,45.72 v38.73,45.72 26.04,45.72 23.5,43.18 22.86,43.18 IC14.14 C2.1 18.41,41.91 17.78,42.55 14.61,42.55 v8.89,48.26 | IC13.10 53.02,68.58 54.29,67.31 60.09,67.31 61.36,68.58 63.5,68.58 IC11.10
X2
  Top 0.254: JP4.1 IC5.5
X3
  Top 0.254: JP4.2 IC5.6

### Text on the board
tPlace: 74HC138 | 100nF | 74HC30 | 74HC11 | 74HC00 | 74HC04 | 100nF | 74HC173 | 74HC595 | 74HC574 | 74HC165 | 100nF | 100nF | 74HC574 | intern | extern | Minimal 64x4 Expansion Rev.7 | 74HC163 | 100nF | 100nF | 74HC32 | SN76489 | Sound | /CS | SCK | MOSI | MISO | VCC | GND | 2N7000 | 100nF | 100nF | NE555 | SD | SN76489 | 100nF | 1M